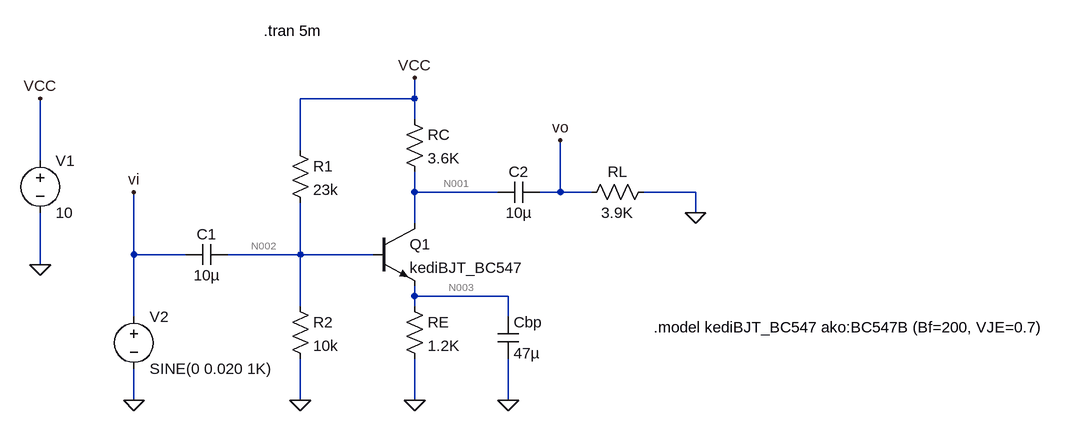
[diagram p0: schematic exp61.asc]
exp61.asc, the LTspice schematic file:
Version 4
SHEET 1 1048 680
WIRE 32 -160 32 -192
WIRE 32 -160 -144 -160
WIRE 32 -128 32 -160
WIRE -144 -80 -144 -160
WIRE -544 -64 -544 -160
WIRE 32 -16 32 -48
WIRE 160 -16 32 -16
WIRE 256 -16 256 -96
WIRE 256 -16 224 -16
WIRE 304 -16 256 -16
WIRE 464 -16 384 -16
WIRE 464 16 464 -16
WIRE 32 32 32 -16
WIRE -400 80 -400 -16
WIRE -320 80 -400 80
WIRE -144 80 -144 0
WIRE -144 80 -256 80
WIRE -32 80 -144 80
WIRE -544 96 -544 16
WIRE 32 144 32 128
WIRE 176 144 32 144
WIRE -144 160 -144 80
WIRE 32 160 32 144
WIRE -400 176 -400 80
WIRE 176 176 176 144
WIRE -400 304 -400 256
WIRE -144 304 -144 240
WIRE 32 304 32 240
WIRE 176 304 176 240
FLAG -544 96 0
FLAG -544 -160 VCC
FLAG 32 -192 VCC
FLAG -144 304 0
FLAG 32 304 0
FLAG 464 16 0
FLAG -400 304 0
FLAG 176 304 0
FLAG 256 -96 vo
FLAG -400 -16 vi
SYMBOL npn -32 32 R0
SYMATTR InstName Q1
SYMATTR Value kediBJT_BC547
SYMBOL res 16 -144 R0
SYMATTR InstName RC
SYMATTR Value 3.6K
SYMBOL voltage -544 -80 R0
WINDOW 123 0 0 Left 0
WINDOW 39 0 0 Left 0
SYMATTR InstName V1
SYMATTR Value 10
SYMBOL res -160 -96 R0
SYMATTR InstName R1
SYMATTR Value 23k
SYMBOL res 16 144 R0
SYMATTR InstName RE
SYMATTR Value 1.2K
SYMBOL res -160 144 R0
SYMATTR InstName R2
SYMATTR Value 10k
SYMBOL cap -256 64 R90
WINDOW 0 0 32 VBottom 2
WINDOW 3 32 32 VTop 2
SYMATTR InstName C1
SYMATTR Value 10µ
SYMBOL cap 224 -32 R90
WINDOW 0 0 32 VBottom 2
WINDOW 3 32 32 VTop 2
SYMATTR InstName C2
SYMATTR Value 10µ
SYMBOL res 400 -32 R90
WINDOW 0 0 56 VBottom 2
WINDOW 3 32 56 VTop 2
SYMATTR InstName RL
SYMATTR Value 3.9K
SYMBOL voltage -400 160 R0
WINDOW 123 0 0 Left 0
WINDOW 39 0 0 Left 0
SYMATTR InstName V2
SYMATTR Value SINE(0 0.020 1K)
SYMBOL cap 160 176 R0
SYMATTR InstName Cbp
SYMATTR Value 47µ
TEXT 400 192 Left 2 !.model kediBJT_BC547 ako:BC547B (Bf=200, VJE=0.7)
TEXT -200 -264 Left 2 !.tran 5m

The netlist it stands for:
* exp61.asc
Q1 N001 N002 N003 0 kediBJT_BC547
RC VCC N001 3.6K
V1 VCC 0 10
R1 VCC N002 23k
RE N003 0 1.2K
R2 N002 0 10k
C1 N002 vi 10µ
C2 vo N001 10µ
RL 0 vo 3.9K
V2 vi 0 SINE(0 0.020 1K)
Cbp N003 0 47µ
.model NPN NPN
.model PNP PNP
.lib standard.bjt
.model kediBJT_BC547 ako:BC547B (Bf=200, VJE=0.7)
.tran 5m
.backanno
.end

* Results of the author's LTspice run, read from the files saved beside the schematic
* Operating Point, zero values left out:
*   V(n001) = 3.123 V
*   V(n002) = 2.961 V
*   V(n003) = 2.304 V
*   V(vcc) = 10 V
*   Ic(Q1) = 1.91 mA
*   Ib(Q1) = 9.965 µA
*   Ie(Q1) = -1.92 mA
*   I(R2) = 296.1 µA
*   I(Re) = 1.92 mA
*   I(R1) = 306 µA
*   I(Rc) = 1.91 mA
*   I(V1) = -2.216 mA
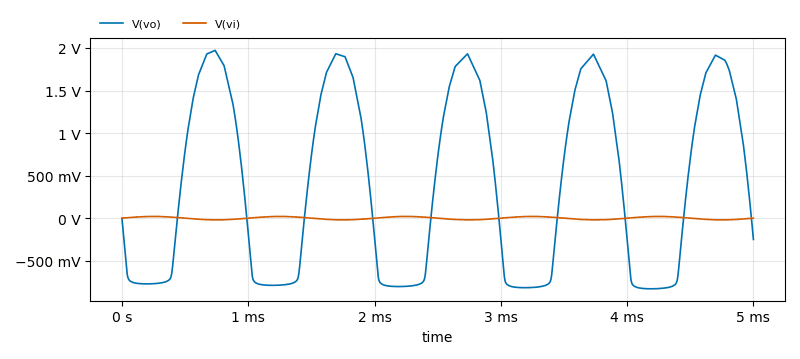
[diagram p1: Transient Analysis of exp61.asc, plotted from the saved traces]
* Transient Analysis, 1 run:
*   V(vo): min -829.8 mV, max 1.972 V, average 387.3 mV, rms 1.16 V, last -250 mV
*   V(vi): min -19.94 mV, max 20 mV, average 98.47 µV, rms 14.05 mV, last 0 V